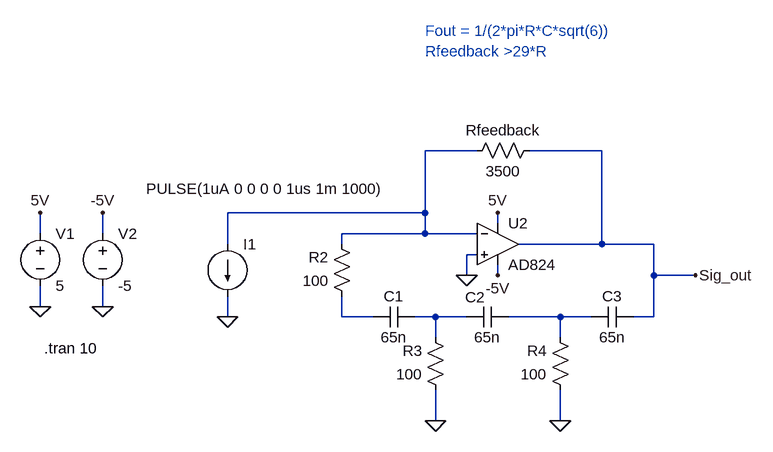
[diagram p0: schematic phase_shift_oscillator.asc]
phase_shift_oscillator.asc, the LTspice schematic file:
Version 4
SHEET 1 880 680
WIRE 224 0 144 0
WIRE 416 0 304 0
WIRE 144 96 144 0
WIRE 144 96 -160 96
WIRE 256 112 256 96
WIRE -448 128 -448 96
WIRE -352 128 -352 96
WIRE 144 128 144 96
WIRE 144 128 16 128
WIRE 224 128 144 128
WIRE -160 144 -160 96
WIRE 16 144 16 128
WIRE 416 144 416 0
WIRE 416 144 288 144
WIRE 496 144 416 144
WIRE 224 160 208 160
WIRE 208 192 208 160
WIRE 256 192 256 176
WIRE 496 192 496 144
WIRE 560 192 496 192
WIRE -448 240 -448 208
WIRE -352 240 -352 208
WIRE -160 256 -160 224
WIRE 16 256 16 224
WIRE 64 256 16 256
WIRE 160 256 128 256
WIRE 208 256 160 256
WIRE 352 256 272 256
WIRE 400 256 352 256
WIRE 496 256 496 192
WIRE 496 256 464 256
WIRE 160 288 160 256
WIRE 352 288 352 256
WIRE 160 416 160 368
WIRE 352 416 352 368
FLAG -448 240 0
FLAG -448 96 5V
FLAG 256 96 5V
FLAG 208 192 0
FLAG 160 416 0
FLAG 352 416 0
FLAG -160 256 0
FLAG -352 240 0
FLAG -352 96 -5V
FLAG 256 192 -5V
FLAG 560 192 Sig_out
SYMBOL voltage -448 112 R0
WINDOW 123 0 0 Left 0
WINDOW 39 0 0 Left 0
SYMATTR InstName V1
SYMATTR Value 5
SYMBOL res 320 -16 R90
WINDOW 0 0 56 VBottom 2
WINDOW 3 32 56 VTop 2
SYMATTR InstName Rfeedback
SYMATTR Value 3500
SYMBOL res 32 240 R180
WINDOW 0 36 76 Left 2
WINDOW 3 36 40 Left 2
SYMATTR InstName R2
SYMATTR Value 100
SYMBOL res 176 384 R180
WINDOW 0 36 76 Left 2
WINDOW 3 36 40 Left 2
SYMATTR InstName R3
SYMATTR Value 100
SYMBOL res 368 384 R180
WINDOW 0 36 76 Left 2
WINDOW 3 36 40 Left 2
SYMATTR InstName R4
SYMATTR Value 100
SYMBOL cap 128 240 R90
WINDOW 0 0 32 VBottom 2
WINDOW 3 32 32 VTop 2
SYMATTR InstName C1
SYMATTR Value 65n
SYMBOL cap 272 240 R90
WINDOW 0 1 51 VBottom 2
WINDOW 3 32 32 VTop 2
SYMATTR InstName C2
SYMATTR Value 65n
SYMBOL cap 464 240 R90
WINDOW 0 0 32 VBottom 2
WINDOW 3 32 32 VTop 2
SYMATTR InstName C3
SYMATTR Value 65n
SYMBOL OpAmps\\AD824 256 80 R0
SYMATTR InstName U2
SYMBOL current -160 144 R0
WINDOW 3 -125 -85 Left 2
WINDOW 123 0 0 Left 0
WINDOW 39 0 0 Left 0
SYMATTR InstName I1
SYMATTR Value PULSE(1uA 0 0 0 0 1us 1m 1000)
SYMBOL voltage -352 112 R0
WINDOW 123 0 0 Left 0
WINDOW 39 0 0 Left 0
SYMATTR InstName V2
SYMATTR Value -5
TEXT -442 304 Left 2 !.tran 10
TEXT 144 -184 Left 2 ;Fout = 1/(2*pi*R*C*sqrt(6))\nRfeedback >29*R

The netlist it stands for:
* phase_shift_oscillator.asc
V1 5V 0 5
Rfeedback Sig_out N001 3500
R2 N002 N001 100
R3 0 N003 100
R4 0 N004 100
C1 N003 N002 65n
C2 N004 N003 65n
C3 Sig_out N004 65n
XU2 0 N001 5V -5V Sig_out AD824  ; pins In+ In- V+ V- OUT
I1 N001 0 PULSE(1uA 0 0 0 0 1us 1m 1000)
V2 -5V 0 -5
.tran 10
* Fout = 1/(2*pi*R*C*sqrt(6))
* Rfeedback >29*R
.backanno
.end